# Altium schematic sheet ltk-hall_main_vh.SchDoc: MAIN / VHALL
size A3; Organization: Altium Limited; Address1: L3, 12a Rodborough Rd; Address2: Frenchs Forest; Address3: NSW; Address4: Australia 2086; DocumentNumber: 5; SheetNumber: 5; SheetTotal: 6
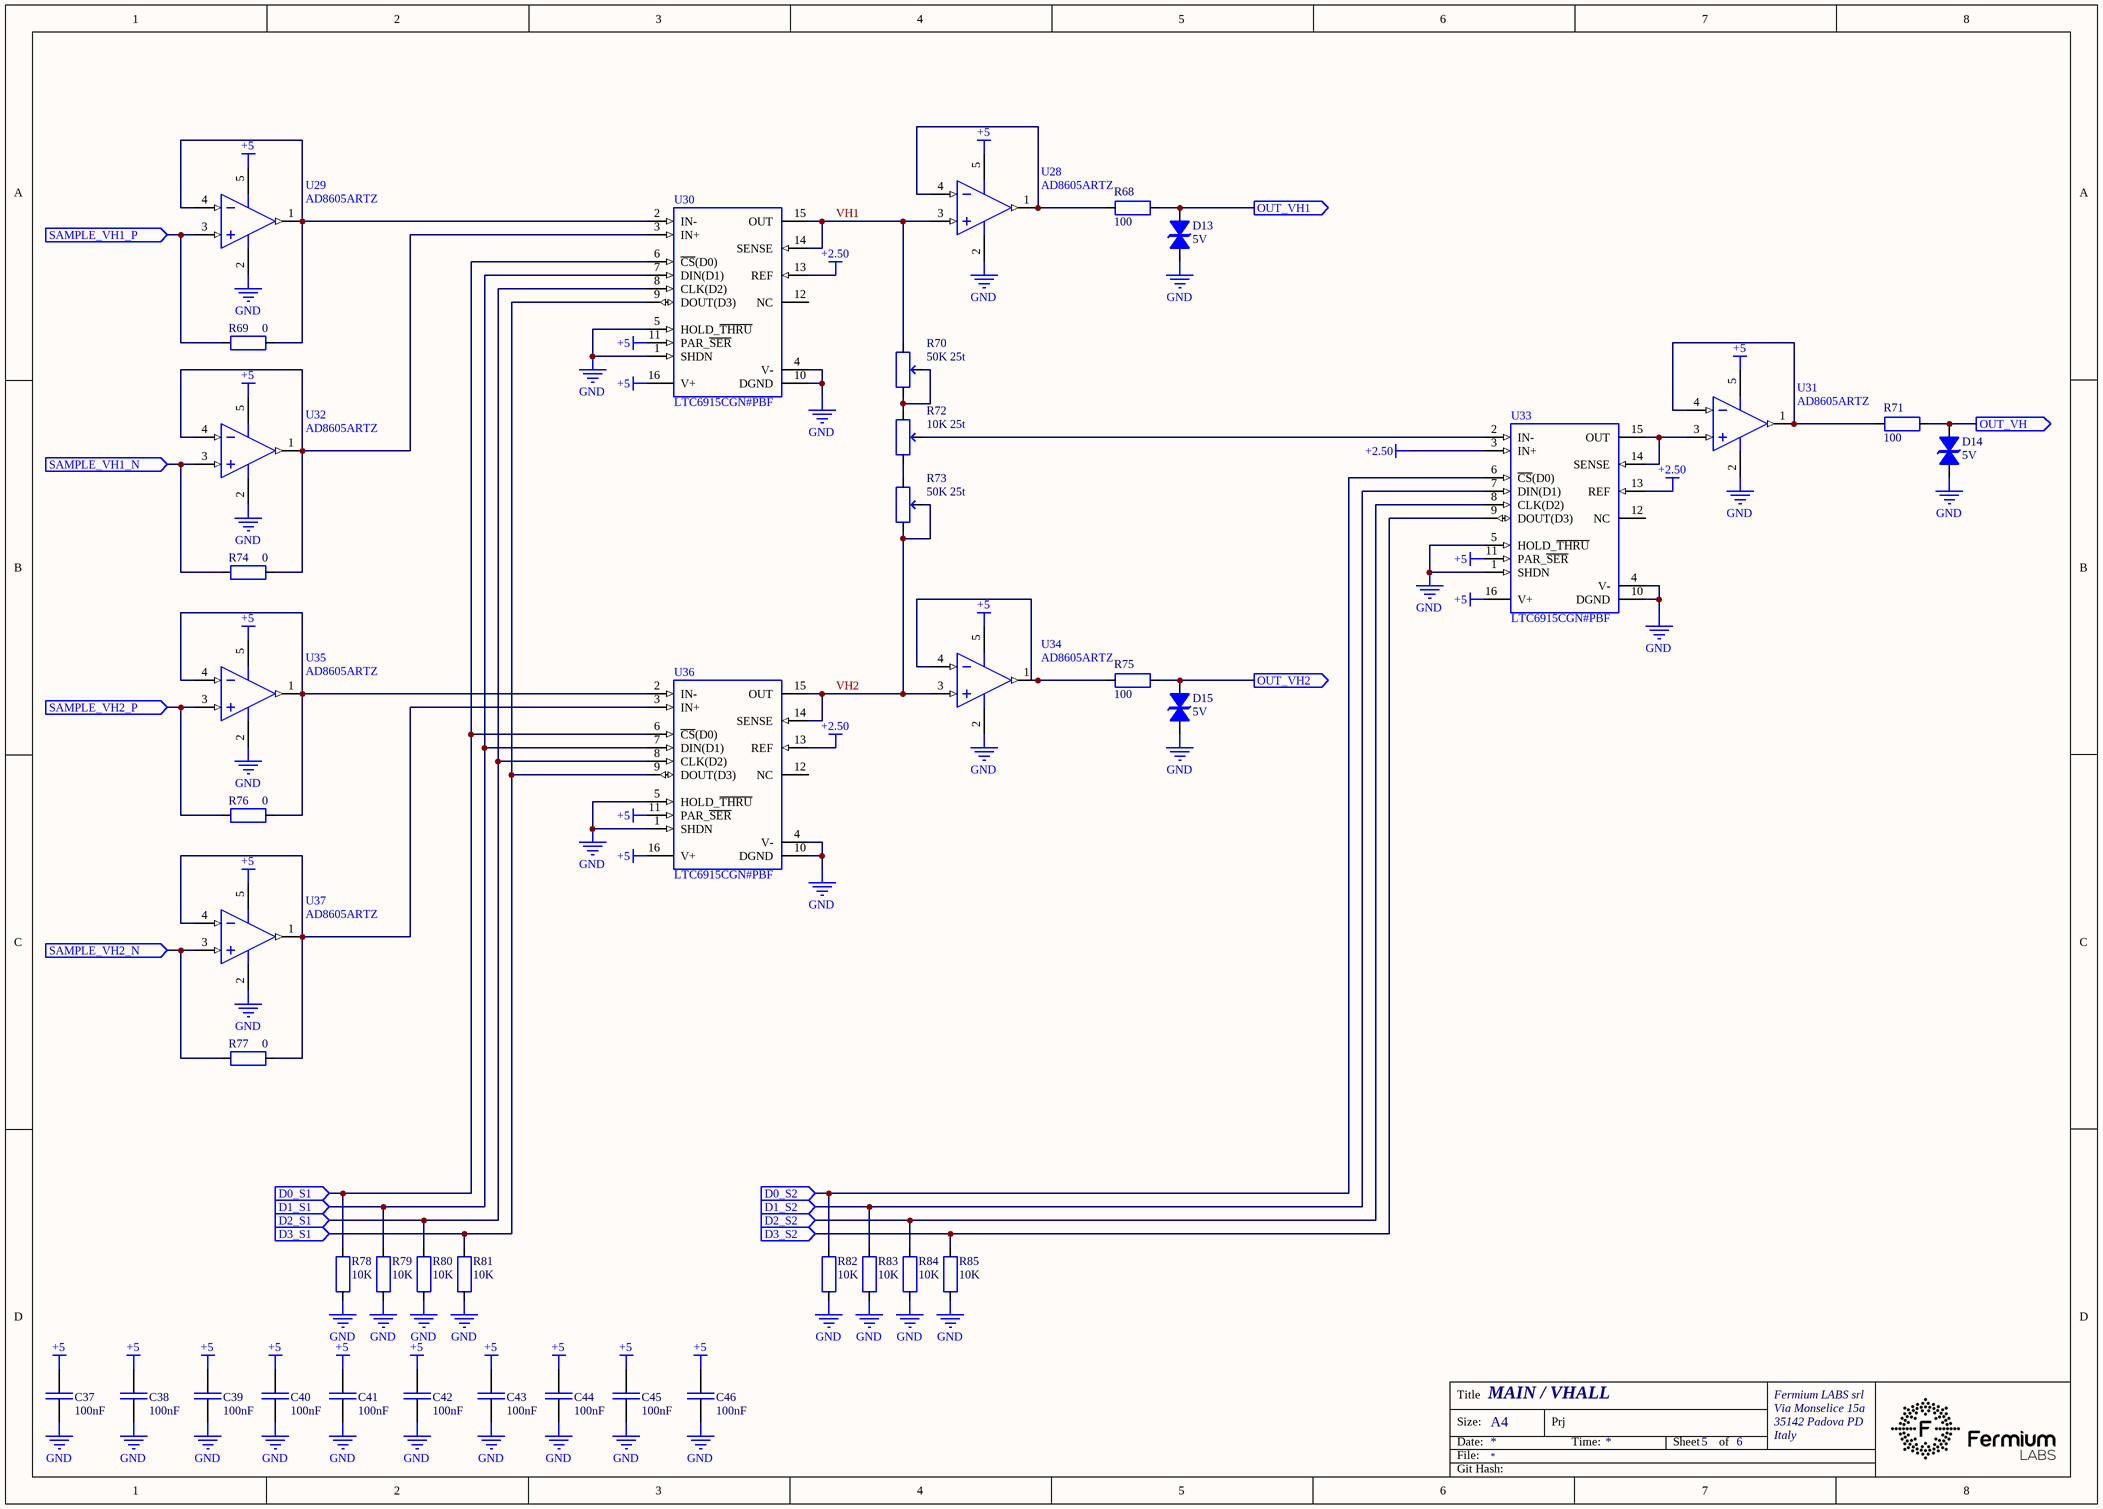
[diagram p0: ltk-hall_main_vh.SchDoc]

## Parts
C37  100nF  [CAP 0603_1608]
C38  100nF  [CAP 0603_1608]
C39  100nF  [CAP 0603_1608]
C40  100nF  [CAP 0603_1608]
C41  100nF  [CAP 0603_1608]
C42  100nF  [CAP 0603_1608]
C43  100nF  [CAP 0603_1608]
C44  100nF  [CAP 0603_1608]
C45  100nF  [CAP 0603_1608]
C46  100nF  [CAP 0603_1608]
D13  5V  [SOD523F]
D14  5V  [SOD523F]
D15  5V  [SOD523F]
R68  100  [RES 0603_1608]
R69  0  [RES 0603_1608]
R70  50K 25t  [F9540903-09ED-4909-856A-DED10E64451E]
R71  100  [RES 0603_1608]
R72  10K 25t  [F9540903-09ED-4909-856A-DED10E64451E]
R73  50K 25t  [F9540903-09ED-4909-856A-DED10E64451E]
R74  0  [RES 0603_1608]
R75  100  [RES 0603_1608]
R76  0  [RES 0603_1608]
R77  0  [RES 0603_1608]
R78  10K  [RES 0603_1608]
R79  10K  [RES 0603_1608]
R80  10K  [RES 0603_1608]
R81  10K  [RES 0603_1608]
R82  10K  [RES 0603_1608]
R83  10K  [RES 0603_1608]
R84  10K  [RES 0603_1608]
R85  10K  [RES 0603_1608]
U28  AD8605ARTZ  [A3DDA0BC-073E-4B18-9613-F713A7EC1E27]
U29  AD8605ARTZ  [A3DDA0BC-073E-4B18-9613-F713A7EC1E27]
U30  LTC6915CGN#PBF  [517EE8A2-9FD8-4174-996D-BDBF76CA3EEB]
U31  AD8605ARTZ  [A3DDA0BC-073E-4B18-9613-F713A7EC1E27]
U32  AD8605ARTZ  [A3DDA0BC-073E-4B18-9613-F713A7EC1E27]
U33  LTC6915CGN#PBF  [517EE8A2-9FD8-4174-996D-BDBF76CA3EEB]
U34  AD8605ARTZ  [A3DDA0BC-073E-4B18-9613-F713A7EC1E27]
U35  AD8605ARTZ  [A3DDA0BC-073E-4B18-9613-F713A7EC1E27]
U36  LTC6915CGN#PBF  [517EE8A2-9FD8-4174-996D-BDBF76CA3EEB]
U37  AD8605ARTZ  [A3DDA0BC-073E-4B18-9613-F713A7EC1E27]

## Ports
D0_S1 (in), D0_S2 (in), D1_S1 (in), D1_S2 (in), D2_S1 (in), D2_S2 (in), D3_S1 (in), D3_S2 (in), OUT_VH1 (out), OUT_VH2 (out), OUT_VH (out), SAMPLE_VH1_N (in), SAMPLE_VH1_P (in), SAMPLE_VH2_N (in), SAMPLE_VH2_P (in)

## Nets
+2.50: U30.13(REF) U33.3(IN+) U33.13(REF) U36.13(REF)
+5: C37.1 C38.1 C39.1 C40.1 C41.1 C42.1 C43.1 C44.1 C45.1 C46.1 U28.5(+V) U29.5(+V) U30.11(PAR_~{SER}) U30.16(V+) U31.5(+V) U32.5(+V) U33.11(PAR_~{SER}) U33.16(V+) U34.5(+V) U35.5(+V) U36.11(PAR_~{SER}) U36.16(V+) U37.5(+V)
GND: C37.2 C38.2 C39.2 C40.2 C41.2 C42.2 C43.2 C44.2 C45.2 C46.2 D13.2 D14.2 D15.2 R78.1 R79.1 R80.1 R81.1 R82.1 R83.1 R84.1 R85.1 U28.2(-V) U29.2(-V) U30.1(SHDN) U30.4(V-) U30.5(HOLD_~{THRU}) U30.10(DGND) U31.2(-V) U32.2(-V) U33.1(SHDN) U33.4(V-) U33.5(HOLD_~{THRU}) U33.10(DGND) U34.2(-V) U35.2(-V) U36.1(SHDN) U36.4(V-) U36.5(HOLD_~{THRU}) U36.10(DGND) U37.2(-V)
D0_S1: R78.2 U30.6(~{CS}(D0)) U36.6(~{CS}(D0)) ; port D0_S1
D0_S2: R82.2 U33.6(~{CS}(D0)) ; port D0_S2
D1_S1: R79.2 U30.7(DIN(D1)) U36.7(DIN(D1)) ; port D1_S1
D1_S2: R83.2 U33.7(DIN(D1)) ; port D1_S2
D2_S1: R80.2 U30.8(CLK(D2)) U36.8(CLK(D2)) ; port D2_S1
D2_S2: R84.2 U33.8(CLK(D2)) ; port D2_S2
D3_S1: R81.2 U30.9(DOUT(D3)) U36.9(DOUT(D3)) ; port D3_S1
D3_S2: R85.2 U33.9(DOUT(D3)) ; port D3_S2
OUT_VH: D14.1 R71.2 ; port OUT_VH
OUT_VH1: D13.1 R68.2 ; port OUT_VH1
OUT_VH2: D15.1 R75.2 ; port OUT_VH2
SAMPLE_VH1_N: R74.1 U32.3(+IN) ; port SAMPLE_VH1_N
SAMPLE_VH1_P: R69.1 U29.3(+IN) ; port SAMPLE_VH1_P
SAMPLE_VH2_N: R77.1 U37.3(+IN) ; port SAMPLE_VH2_N
SAMPLE_VH2_P: R76.1 U35.3(+IN) ; port SAMPLE_VH2_P
VH1: R70.1 U28.3(+IN) U30.14(SENSE) U30.15(OUT)
VH2: R73.2 R73.3 U34.3(+IN) U36.14(SENSE) U36.15(OUT)
NetR68_1: R68.1 U28.1(OUT) U28.4(-IN)
NetR69_2: R69.2 U29.1(OUT) U29.4(-IN) U30.2(IN-)
NetR70_2: R70.2 R70.3 R72.3
NetR71_1: R71.1 U31.1(OUT) U31.4(-IN)
NetR72_1: R72.1 R73.1
NetR72_2: R72.2 U33.2(IN-)
NetR74_2: R74.2 U30.3(IN+) U32.1(OUT) U32.4(-IN)
NetR75_1: R75.1 U34.1(OUT) U34.4(-IN)
NetR76_2: R76.2 U35.1(OUT) U35.4(-IN) U36.2(IN-)
NetR77_2: R77.2 U36.3(IN+) U37.1(OUT) U37.4(-IN)
NetU31_3: U31.3(+IN) U33.14(SENSE) U33.15(OUT)

Not connected (* = marked no-connect by the designer): U30 12(NC); U33 12(NC); U36 12(NC)

## Notes on the sheet
- Title
- Fermium LABS srl
- Size:
- Date:
- File:
- A4
- Prj
- Time:
- Sheet
- of
- Via Monselice 15a
- 35142 Padova PD
- Italy
- Git Hash:

## Library data of the parts
C37-C46 = 02841f84-ac15-41b5-9e17-915f8f067828: CAP SMD MLCC 100nF 25V 0603 X7R; Manufacturer 1: Samsung Electro-Mechanics; Manufacturer Part Number 1: CL10B104KA8NNNC; id: 14784; S 1: LCSC; SPN 1: C1590; SPN 2: C14663; Part Number: 02841f84-ac15-41b5-9e17-915f8f067828; ComponentLink1Description: Datasheet; ComponentLink1URL: http://localhost:8080/static/files/Samsung-Electro-Mechanics-CL10B104KA8NNNC_C15902019-03-10_215548.826887.pdf?Samsung-Electro-Mechanics-CL10B104KA8NNNC_C1590.pdf; Value: 100nF; Manufacturer 2: Yageo; Manufacturer Part Number 2: CC0603KRX7R9BB104; S 2: LCSC
D13-D15 = daa58212-38e2-4326-a156-8e48058c46f1: DIODE SMD TVS 5V BIDIRECTIONAL SOD-523; Manufacturer 1: Born Semiconductor; Manufacturer Part Number 1: PESD5V0S1BBN; id: 14837; S 1: LCSC; SPN 1: C314264; SPN 2: C97640; Part Number: daa58212-38e2-4326-a156-8e48058c46f1; ComponentLink1Description: Datasheet; ComponentLink1URL: http://localhost:8080/static/files/Nexperia-PESD5V0S1BB-115_C976402019-08-16_201905.624024.pdf?Nexperia-PESD5V0S1BB-115_C97640.pdf; ComponentLink2Description: Datasheet; ComponentLink2URL: http://localhost:8080/static/files/1901051701_Bourne-Semicon-Shenzhen-PESD5V0S1BBN_C3142642019-08-16_201911.992552.pdf?1901051701_Bourne-Semicon-Shenzhen-PESD5V0S1BBN_C314264.pdf; Manufacturer 2: Nexperia; Manufacturer Part Number 2: PESD5V0S1BB,115; Value: 5V; S 2: LCSC
R68 R71 R75 = 0a6c4b74-f837-4563-b154-6e196d753525: RES SMD 100 OHM 1% 1/10W 0603; Manufacturer 1: Yageo; Manufacturer Part Number 1: RC0603FR-07100RL; id: 12301; S 1: LCSC; SPN 1: C105588; SPN 2: C22775; Part Number: 0a6c4b74-f837-4563-b154-6e196d753525; Value: 100; Manufacturer 2: Uniroyal; Manufacturer Part Number 2: 0603WAF1000T5E; S 2: LCSC
R69 R74 R76 R77 = 6ae227f9-847f-4766-8522-e11a83531204: RES SMD 0 OHM 5% 1/10W 0603; Manufacturer 1: Yageo; Manufacturer Part Number 1: RC0603JR-070RL; id: 11973; S 1: LCSC; SPN 1: C95177; SPN 2: C21189; Part Number: 6ae227f9-847f-4766-8522-e11a83531204; Value: 0; Manufacturer 2: Uniroyal; Manufacturer Part Number 2: 0603WAF0000T5E; S 2: LCSC
R70 R73 = 90164141-8820-4471-9a6f-9a984ce9068c: POT TRIMMER LINEAR 50K 25TURNS VERT THT; Manufacturer 1: Bourns; Manufacturer Part Number 1: 3296W-1-503LF; id: 14849; S 1: LCSC; SPN 1: C83686; Part Number: 90164141-8820-4471-9a6f-9a984ce9068c; ComponentLink1Description: Datasheet; ComponentLink1URL: http://localhost:8080/static/files/BOURNS-3296W-1-103LF_C34846_12019-08-17_221926.713297.pdf?BOURNS-3296W-1-103LF_C34846 (1).pdf; Value: 50K 25t
R72 = 613f65ed-4d8d-44d0-9fe5-67eff78392c9: POT TRIMMER LINEAR 10K 25TURNS VERT THT; Manufacturer 1: Bourns; Manufacturer Part Number 1: 3296W-1-103LF; id: 14847; S 1: LCSC; SPN 1: C34846; Part Number: 613f65ed-4d8d-44d0-9fe5-67eff78392c9; ComponentLink1Description: 3D Model; ComponentLink1URL: http://localhost:8080/static/files/3296W_v12019-08-17_171307.552870.step?3296W v1.step; ComponentLink2Description: Datasheet; ComponentLink2URL: http://localhost:8080/static/files/BOURNS-3296W-1-103LF_C348462019-08-17_171320.734450.pdf?BOURNS-3296W-1-103LF_C34846.pdf; Value: 10K 25t
R78-R85 = 93242766-ba1d-462d-b58f-ce1dfc4129c8: RES SMD 10K OHM 1% 1/10W 0603; Manufacturer 1: Yageo; Manufacturer Part Number 1: RC0603FR-0710KL; id: 12101; S 1: LCSC; SPN 1: C98220; SPN 2: C25804; Part Number: 93242766-ba1d-462d-b58f-ce1dfc4129c8; Value: 10K; Manufacturer 2: Uniroyal; Manufacturer Part Number 2: 0603WAF1002T5E; S 2: LCSC
U28 U29 U31 U32 U34 U35 U37 = 5610e9ea-bca8-49b2-8e5f-11409231f6a4: IC OPAMP 65uV 1pA RRIO 5V 80mA SOT-23-5; Manufacturer 1: Analog Devices; id: 14830; S 1: LCSC; SPN 1: C9641; Part Number: 5610e9ea-bca8-49b2-8e5f-11409231f6a4; ComponentLink1Description: Datasheet; ComponentLink1URL: http://localhost:8080/static/files/Analog_Devices-AD8605ARTZ-REEL7-datasheet2019-08-16_175825.352099.pdf?Analog_Devices-AD8605ARTZ-REEL7-datasheet.pdf; Manufacturer Part Number 1: AD8605ARTZ
U30 U33 U36 = 59fe82cd-fd18-4813-9f52-e2e78a460aff: IC PGA G0-4094 SPI-PARALLEL 5V RRIO SSOP-16; Manufacturer 1: Analog Devices; id: 14835; S 1: Mouser; SPN 1: 584-LTC6915CGN#PBF; Part Number: 59fe82cd-fd18-4813-9f52-e2e78a460aff; ComponentLink1Description: Datasheet; ComponentLink1URL: http://localhost:8080/static/files/Linear_Technology-LTC6915CDEPBF-datasheet2019-08-16_194420.284095.pdf?Linear_Technology-LTC6915CDE#PBF-datasheet.pdf; Manufacturer Part Number 1: LTC6915CGN#PBF